# Altium schematic sheet ShematicShieldCerveau.SchDoc
size A4
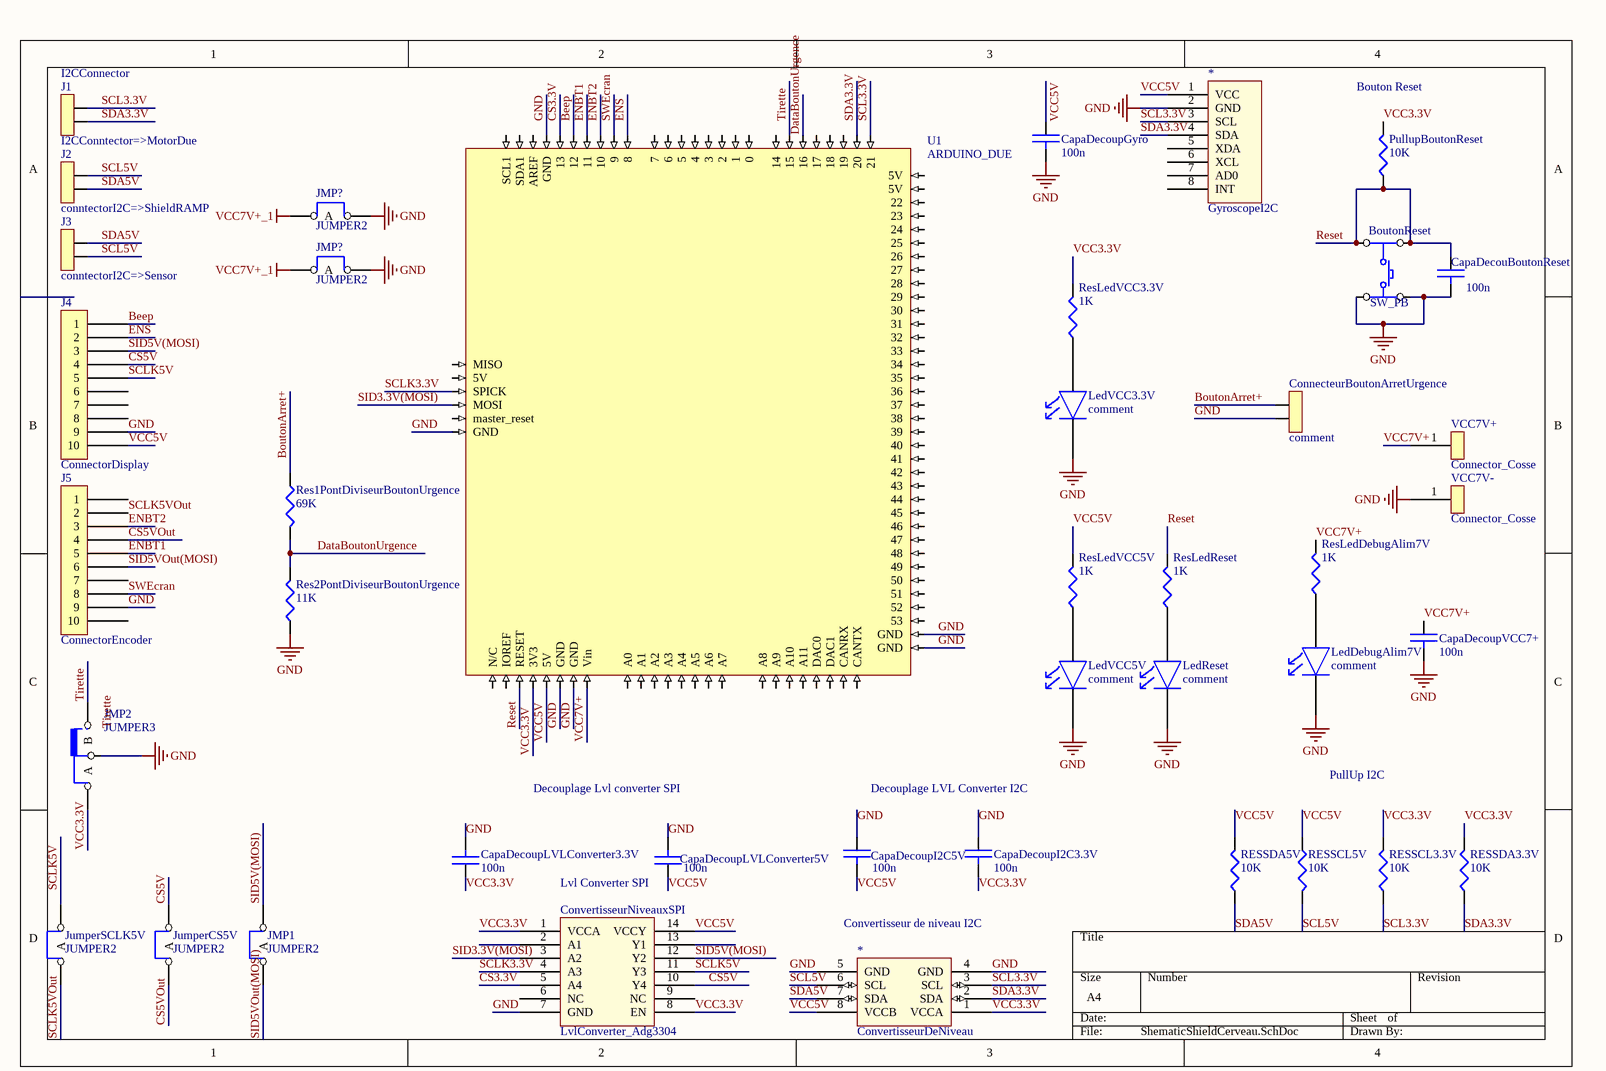
[diagram p0: ShematicShieldCerveau.SchDoc]

## Parts
(Parts that share a designator on the sheet are numbered #1, #2 ... from top to bottom, then left to right.)
*#1  GyroscopeI2C  [GyroscopeI2C]
*#2  ConvertisseurDeNiveau  [ConvertisseurDeniveauxI2C]
BoutonReset  SW_PB  [KSA]
CapaDecouBoutonReset  value 100n  [0805]  (hidden comment: CAP)
CapaDecoupGyro  value 100n  [0805]  (hidden comment: CAP)
CapaDecoupI2C3.3V  value 100n  [0805]  (hidden comment: CAP)
CapaDecoupI2C5V  value 100n  [0805]  (hidden comment: CAP)
CapaDecoupLVLConverter3.3V  value 100n  [0805]  (hidden comment: CAP)
CapaDecoupLVLConverter5V  value 100n  [0805]  (hidden comment: CAP)
CapaDecoupVCC7+  value 100n  [0805]  (hidden comment: CAP)
ConnecteurBoutonArretUrgence  comment  [AMP_2]
ConvertisseurNiveauxSPI  LvlConverter_Adg3304  [LvlConverter_Adg3304]
J1  I2CConntector=>MotorDue  [AMP_2]
J2  conntectorI2C=>ShieldRAMP  [AMP_2]
J3  conntectorI2C=>Sensor  [AMP_2]
J4  ConnectorDisplay  [HE10-10V]
J5  ConnectorEncoder  [HE10-10V]
JMP1  JUMPER2  [JMP2-100]
JMP2  JUMPER3  [JMP3-100]
JMP?#1  JUMPER2  [JMP2-100]
JMP?#2  JUMPER2  [JMP2-100]
JumperCS5V  JUMPER2  [JMP2-100]
JumperSCLK5V  JUMPER2  [JMP2-100]
LedDebugAlim7V  comment  [LED0805]
LedReset  comment  [LED0805]
LedVCC3.3V  comment  [LED0805]
LedVCC5V  comment  [LED0805]
PullupBoutonReset  value 10K  [0805]  (hidden comment: RES)
Res1PontDiviseurBoutonUrgence  value 69K  [0805]  (hidden comment: RES)
Res2PontDiviseurBoutonUrgence  value 11K  [0805]  (hidden comment: RES)
ResLedDebugAlim7V  value 1K  [0805]  (hidden comment: RES)
ResLedReset  value 1K  [0805]  (hidden comment: RES)
ResLedVCC3.3V  value 1K  [0805]  (hidden comment: RES)
ResLedVCC5V  value 1K  [0805]  (hidden comment: RES)
RESSCL3.3V  value 10K  [0805]  (hidden comment: RES)
RESSCL5V  value 10K  [0805]  (hidden comment: RES)
RESSDA3.3V  value 10K  [0805]  (hidden comment: RES)
RESSDA5V  value 10K  [0805]  (hidden comment: RES)
U1  ARDUINO_DUE  [ARDUINO_DUE]
VCC7V+  Connector_Cosse  [Connector_Cosse]
VCC7V-  Connector_Cosse  [Connector_Cosse]

## Nets
GND: *#1.2(GND) *#2.4(GND) *#2.5(GND) BoutonReset.3 BoutonReset.4 CapaDecouBoutonReset.2 CapaDecoupGyro.2 CapaDecoupI2C3.3V.1 CapaDecoupI2C5V.1 CapaDecoupLVLConverter3.3V.2 CapaDecoupLVLConverter5V.2 CapaDecoupVCC7+.2 ConnecteurBoutonArretUrgence.1 ConvertisseurNiveauxSPI.7(GND) J4.9 J5.9 JMP2.3(com) JMP?#1.2(com) JMP?#2.2(com) LedDebugAlim7V.K LedReset.K LedVCC3.3V.K LedVCC5V.K Res2PontDiviseurBoutonUrgence.1 U1.4(GND) U1.61(GND) U1.62(GND) U1.80(GND) U1.81(GND) U1.92(GND) VCC7V-.1
VCC7V+_1: JMP?#1.1(A) JMP?#2.1(A)
Beep: J4.1 U1.6(12)
BoutonArret+: ConnecteurBoutonArretUrgence.2 Res1PontDiviseurBoutonUrgence.1
CS3.3V: ConvertisseurNiveauxSPI.5(A4) U1.5(13)
CS5V: ConvertisseurNiveauxSPI.10(Y4) J4.4 JumperCS5V.2(com)
CS5VOut: J5.4 JumperCS5V.1(A)
DataBoutonUrgence: Res1PontDiviseurBoutonUrgence.2 Res2PontDiviseurBoutonUrgence.2 U1.21(16)
ENBT1: J5.5 U1.7(11)
ENBT2: J5.3 U1.8(10)
ENS: J4.2 U1.10(8)
Reset: BoutonReset.1 BoutonReset.2 CapaDecouBoutonReset.1 PullupBoutonReset.1 ResLedReset.2 U1.84(RESET)
SCL3.3V: *#1.3(SCL) *#2.3(SCL) J1.1 RESSCL3.3V.1 U1.26(21)
SCL5V: *#2.6(SCL) J2.1 J3.2 RESSCL5V.2
SCLK3.3V: ConvertisseurNiveauxSPI.4(A3) U1.89(SPICK)
SCLK5V: ConvertisseurNiveauxSPI.11(Y3) J4.5 JumperSCLK5V.2(com)
SCLK5VOut: J5.2 JumperSCLK5V.1(A)
SDA3.3V: *#1.4(SDA) *#2.2(SDA) J1.2 RESSDA3.3V.1 U1.25(20)
SDA5V: *#2.7(SDA) J2.2 J3.1 RESSDA5V.1
SID3.3V(MOSI): ConvertisseurNiveauxSPI.3(A2) U1.90(MOSI)
SID5V(MOSI): ConvertisseurNiveauxSPI.12(Y2) J4.3 JMP1.2(com)
SID5VOut(MOSI): J5.6 JMP1.1(A)
SWEcran: J5.8 U1.9
Tirette: JMP2.2(B) U1.20(15)
VCC3.3V: *#2.1(VCCA) CapaDecoupI2C3.3V.2 CapaDecoupLVLConverter3.3V.1 ConvertisseurNiveauxSPI.1(VCCA) ConvertisseurNiveauxSPI.8(EN) JMP2.1(A) PullupBoutonReset.2 ResLedVCC3.3V.2 RESSCL3.3V.2 RESSDA3.3V.2 U1.83(3V3)
VCC5V: *#1.1(VCC) *#2.8(VCCB) CapaDecoupGyro.1 CapaDecoupI2C5V.2 CapaDecoupLVLConverter5V.1 ConvertisseurNiveauxSPI.14(VCCY) J4.10 ResLedVCC5V.2 RESSCL5V.1 RESSDA5V.2 U1.82(5V)
VCC7V+: CapaDecoupVCC7+.1 ResLedDebugAlim7V.2 U1.79(Vin) VCC7V+.1
NetLedDebugAlim7V_A: LedDebugAlim7V.A ResLedDebugAlim7V.1
NetLedReset_A: LedReset.A ResLedReset.1
NetLedVCC3.3V_A: LedVCC3.3V.A ResLedVCC3.3V.1
NetLedVCC5V_A: LedVCC5V.A ResLedVCC5V.1

Not connected (* = marked no-connect by the designer): *#1 5(XDA) 6(XCL) 7(AD0) 8(INT); ConvertisseurNiveauxSPI 2(A1) 6(NC) 9(NC) 13(Y1); J4 6 7 8; J5 1 7 10; U1 1(SCL1) 2(SDA1) 3(AREF) 11(7) 12(6) 13(5) 14(4) 15(3) 16(2) 17(1) 18(0) 19(14) 22(17) 23(18) 24(19) 27(5V) 28(5V) 29(22) 30(23) 31(24) 32(25) 33(26) 34(27) 35(28) 36(29) 37(30) 38(31) 39(32) 40(33) 41(34) 42(35) 43(36) 44(37) 45(38) 46(39) 47(40) 48(41) 49(42) 50(43) 51(44) 52(45) 53(46) 54(47) 55(48) 56(49) 57(50) 58(51) 59(52) 60(53) 63(CANTX) 64(CANRX) 65(DAC1) 66(DAC0) 67(A11) 68(A10) 69(A9) 70(A8) 71(A7) 72(A6) 73(A5) 74(A4) 75(A3) 76(A2) 77(A1) 78(A0) 85(IOREF) 86(N/C) 87(MISO) 88(5V) 91(master_reset)

## Notes on the sheet
- (near J1) I2CConnector
- (near PullupBoutonReset) Bouton Reset
- Decouplage Lvl converter SPI
- Decouplage LVL Converter I2C
- PullUp I2C
- (near CapaDecoupLVLConverter5V) Lvl Converter SPI
- Convertisseur de niveau I2C
- Labels drawn without touching a wire or pin: Tirette

## Library data of the parts
CapaDecouBoutonReset CapaDecoupGyro CapaDecoupI2C3.3V CapaDecoupI2C5V CapaDecoupLVLConverter3.3V CapaDecoupLVLConverter5V CapaDecoupVCC7+ = CAP: capacité non polarisée
ConnecteurBoutonArretUrgence J1-J3 = POWER2: connecteur alim 2 pôles
J4 J5 = HE10-10: 10-pin connector
JMP1 JMP?#1 JMP?#2 JumperCS5V JumperSCLK5V = JUMPER2: cavalier 1 position
JMP2 = JUMPER3: cavalier 2 positions
LedDebugAlim7V LedReset LedVCC3.3V LedVCC5V = LED: LED 5mm/3mm/CMS
PullupBoutonReset Res1PontDiviseurBoutonUrgence Res2PontDiviseurBoutonUrgence ResLedDebugAlim7V ResLedReset ResLedVCC3.3V ResLedVCC5V RESSCL3.3V RESSCL5V RESSDA3.3V RESSDA5V = RES: resistance